# EAGLE design ioboard (EAGLE 9.6.2)
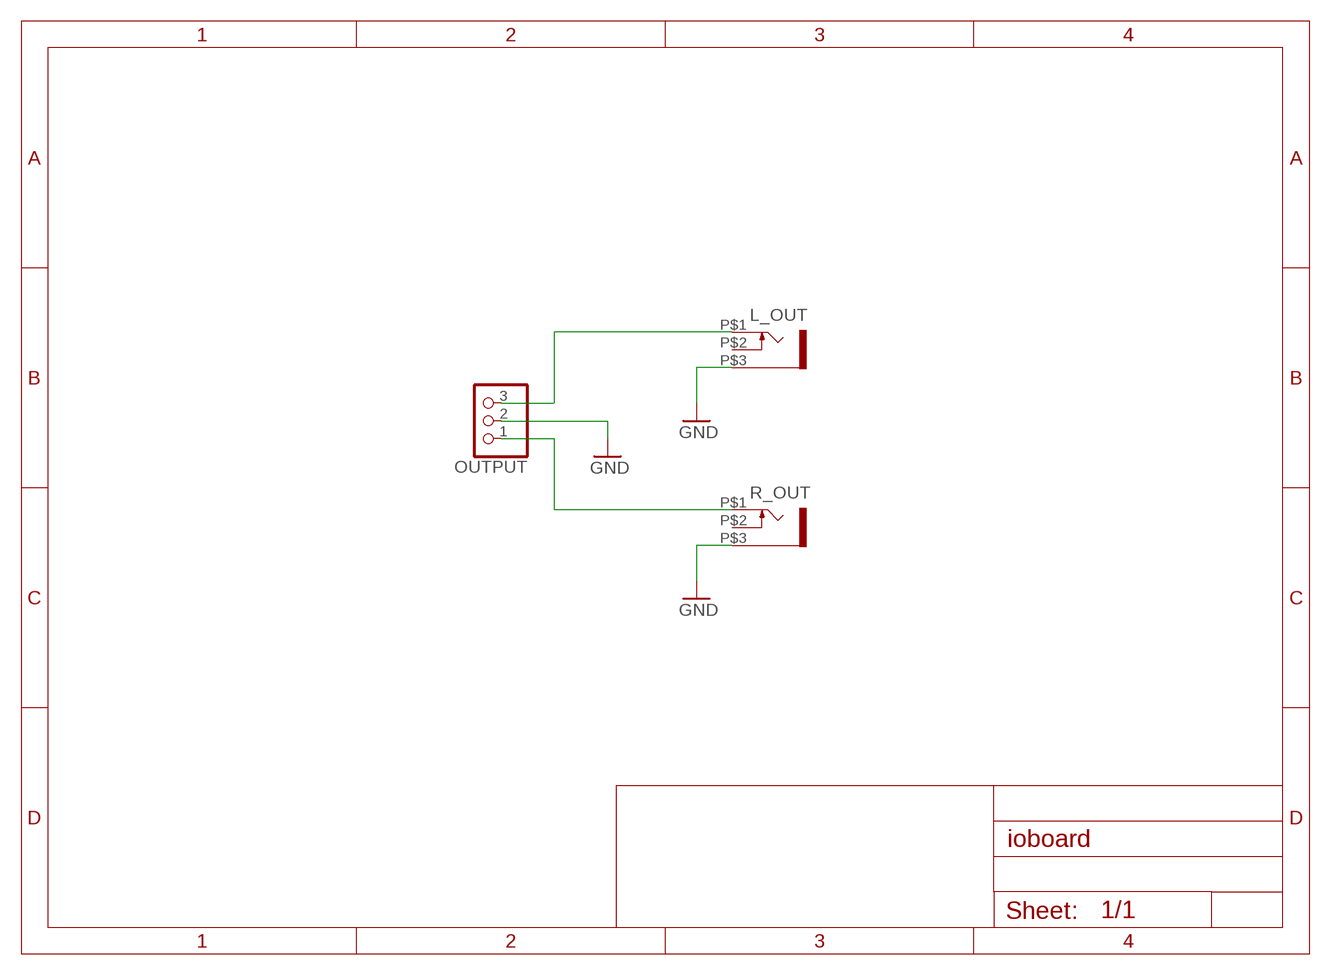
[diagram p0: schematic, sheet 1]

## Parts
L_OUT  WQP-PJ301M-12_JACK  [WQP-PJ301M-12_JACK]
OUTPUT  PINHD-1X3  [1X03]
R_OUT  WQP-PJ301M-12_JACK  [WQP-PJ301M-12_JACK]

## Nets
GND: L_OUT.P$3 OUTPUT.2 R_OUT.P$3
LEFT_OUT: L_OUT.P$1 OUTPUT.3
RIGHT_OUT: OUTPUT.1 R_OUT.P$1
Unconnected: L_OUT.P$2 R_OUT.P$2

## Library data of the parts
L_OUT R_OUT = thonkiconn:WQP-PJ301M-12_JACK
OUTPUT = pinhead:PINHD-1X3: PIN HEADER

## Board
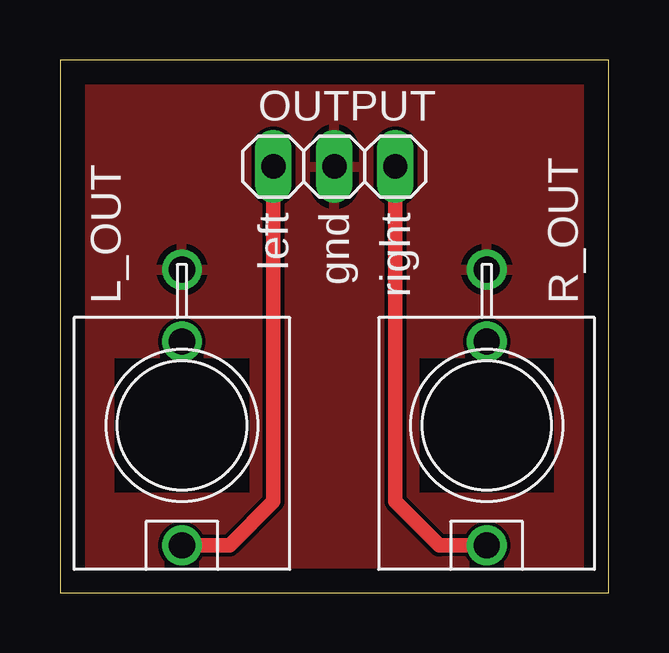
[diagram p1: board, top side]
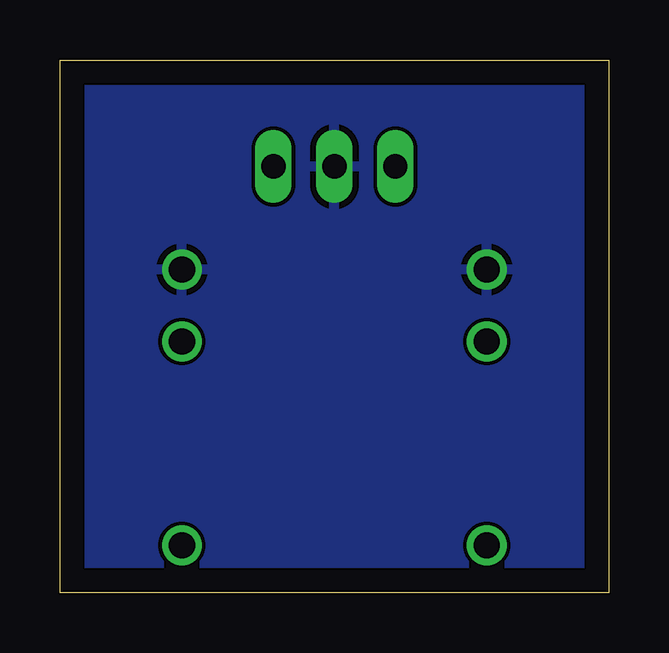
[diagram p2: board, bottom side, seen from below]

Size 22.86 x 22.23 mm. Coordinates in mm from the lower left corner, seen from the top.
Outline: 0,0 22.86,0 22.86,22.23 0,22.23 0,0
Copper layers (1*16): Top 0.035mm / dielectric 1.5mm / Bottom 0.035mm
Design rules "default": minimum track width 6mil, minimum drill 0.35mm, track to track 6mil, track to pad 6mil, pad to pad 6mil, via to via 6mil, smd to smd 6mil, copper to edge 40mil, drill to drill 6mil, minimum pad ring 10mil, minimum via ring 8mil, stop-mask expansion 4mil, vias tented up to drill 0mil, thermal gap 10mil

### Footprints (pad centres in the part's own frame; a part is rotated, then mirrored left to right if it is on the bottom)
WQP-PJ301M-12_JACK = drill 1.1: P$1 0,5; P$2 0,-3.5; P$3 0,-6.5
1X03 = drill 1.016 long: 1 -2.54,0; 2 0,0; 3 2.54,0

### Placement (x,y rotation side)
L_OUT  5.08,6.99 180 top
OUTPUT  11.43,17.78 180 top
R_OUT  17.78,6.99 180 top

### Tracks (layer width: path | path; a pad name or v marks a point on that pad's centre or on a via)
GND
  pour Top: 0,22.23 0,0 22.86,0 22.86,22.23
  pour Bottom: 0,22.23 0,0 22.86,0 22.86,22.23
LEFT_OUT
  Top 0.61: OUTPUT.3 8.89,3.81 7.07,1.99 L_OUT.P$1
RIGHT_OUT
  Top 0.61: OUTPUT.1 13.97,3.81 15.79,1.99 R_OUT.P$1

### Text on the board
tNames: left | gnd | right